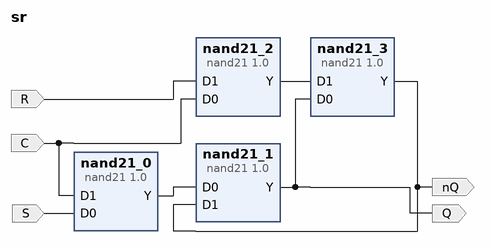
[diagram p0: block diagram of the top level]
# Vivado block design sr, xc7a35tcpg236-1, Vivado 2017.4
create_bd_design sr

create_bd_port -dir O Q
create_bd_port -dir O nQ
create_bd_port -dir I S
create_bd_port -dir I R
create_bd_port -dir I C

create_bd_cell -type ip -vlnv xilinx.com:user:nand21:1.0 nand21_0
create_bd_cell -type ip -vlnv xilinx.com:user:nand21:1.0 nand21_1
create_bd_cell -type ip -vlnv xilinx.com:user:nand21:1.0 nand21_2
create_bd_cell -type ip -vlnv xilinx.com:user:nand21:1.0 nand21_3

# ---- connections ----

connect_bd_net [get_bd_pins nand21_0/Y] [get_bd_pins nand21_1/D0]
connect_bd_net [get_bd_pins nand21_2/Y] [get_bd_pins nand21_3/D1]
connect_bd_net [get_bd_pins nand21_1/Y] [get_bd_ports Q] [get_bd_pins nand21_3/D0]
connect_bd_net [get_bd_pins nand21_3/Y] [get_bd_ports nQ] [get_bd_pins nand21_1/D1]
connect_bd_net [get_bd_ports S] [get_bd_pins nand21_0/D0]
connect_bd_net [get_bd_ports R] [get_bd_pins nand21_2/D1]
connect_bd_net [get_bd_ports C] [get_bd_pins nand21_0/D1] [get_bd_pins nand21_2/D0]

validate_bd_design
save_bd_design
